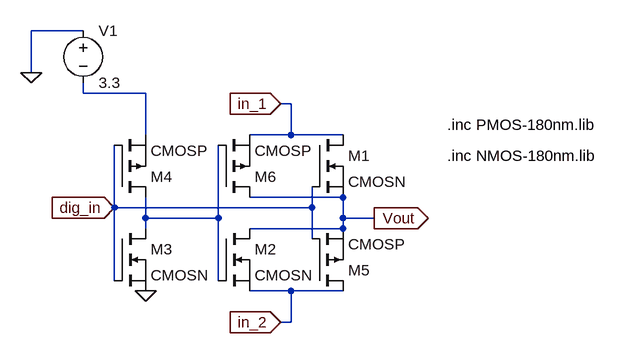
[diagram p0: schematic switch.asc]
switch.asc, the LTspice schematic file:
Version 4
SHEET 1 952 680
WIRE -112 -112 -192 -112
WIRE -192 -48 -192 -112
WIRE -112 -16 -112 -32
WIRE -16 -16 -112 -16
WIRE 208 0 192 0
WIRE -16 48 -16 -16
WIRE 208 48 208 0
WIRE 208 48 144 48
WIRE 288 48 208 48
WIRE 288 144 144 144
WIRE -64 160 -64 64
WIRE 240 160 240 128
WIRE 240 160 -64 160
WIRE -16 176 -16 144
WIRE 96 176 96 64
WIRE 96 176 -16 176
WIRE 288 176 288 144
WIRE 336 176 288 176
WIRE -16 192 -16 176
WIRE 288 192 288 176
WIRE 288 192 144 192
WIRE 240 208 240 160
WIRE -64 272 -64 160
WIRE 96 272 96 176
WIRE 208 288 144 288
WIRE 288 288 208 288
WIRE 208 336 208 288
WIRE 208 336 192 336
FLAG -16 288 0
FLAG -64 160 dig_in
IOPIN -64 160 In
FLAG 192 0 in_1
IOPIN 192 0 In
FLAG 192 336 in_2
IOPIN 192 336 In
FLAG 336 176 Vout
IOPIN 336 176 Out
FLAG -192 -48 0
SYMBOL voltage -112 -128 R0
WINDOW 123 0 0 Left 0
WINDOW 39 0 0 Left 0
SYMATTR InstName V1
SYMATTR Value 3.3
SYMBOL nmos 240 48 R0
SYMATTR InstName M1
SYMATTR Value CMOSN
SYMBOL nmos 96 192 R0
SYMATTR InstName M2
SYMATTR Value CMOSN
SYMBOL nmos -64 192 R0
SYMATTR InstName M3
SYMATTR Value CMOSN
SYMBOL pmos -64 144 M180
SYMATTR InstName M4
SYMATTR Value CMOSP
SYMBOL pmos 240 288 M180
SYMATTR InstName M5
SYMATTR Value CMOSP
SYMBOL pmos 96 144 M180
SYMATTR InstName M6
SYMATTR Value CMOSP
TEXT 448 32 Left 2 !.inc PMOS-180nm.lib
TEXT 448 80 Left 2 !.inc NMOS-180nm.lib

The netlist it stands for:
* switch.asc
V1 0 N001 3.3
M1 in_1 dig_in Vout Vout CMOSN
M2 Vout N002 in_2 in_2 CMOSN
M3 N002 dig_in 0 0 CMOSN
M4 N002 dig_in N001 N001 CMOSP
M5 in_2 dig_in Vout Vout CMOSP
M6 Vout N002 in_1 in_1 CMOSP
.model NMOS NMOS
.model PMOS PMOS
.lib standard.mos
.inc PMOS-180nm.lib
.inc NMOS-180nm.lib
.backanno
.end